# EAGLE design schematic_rev_1 (EAGLE 7.0.0)
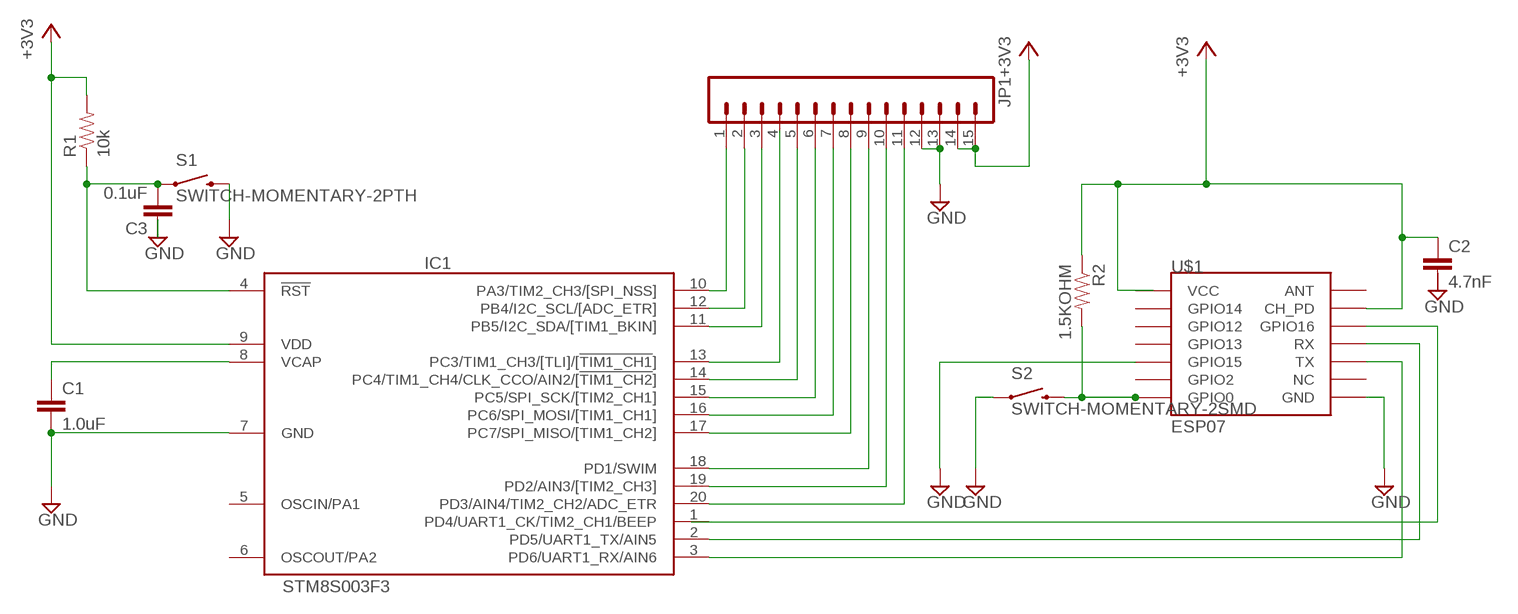
[diagram p0: schematic, sheet 1]

## Parts
C1  1.0uF  1.0UF-16V-10%(0402)  [0402-CAP]
C2  4.7nF  4.7NF-50V-10%(0603)  [0603-CAP]
C3  0.1uF  0.1UF-16V(+-10%)(0402)  [0402-CAP]
IC1  STM8S003F3  [TSSOP20]
JP1  M15  [1X15]
R1  10k  10KOHM-1/4W-1%(PTH)HORIZ  [AXIAL-0.3]
R2  1.5KOHM  1.5KOHM-1/10W-1%(0603)  [0603]
S1  SWITCH-MOMENTARY-2PTH  [TACTILE-PTH]
S2  SWITCH-MOMENTARY-2SMD  [TACTILE-SWITCH-SMD]
U$1  ESP07  [ESP07]

## Nets
+3V3: C2.1 IC1.9(VDD) JP1.14 JP1.15 R1.P$2 R2.1 U$1.CH_PD
GND: C1.2 C3.1 IC1.7(GND) JP1.12 JP1.13 S1.3 S2.1 U$1.GND U$1.GPIO15
N$3: C1.1 IC1.8(VCAP)
N$4: U$1.GPIO16
N$5: IC1.2(PD5/UART1_TX/AIN5) U$1.RX
N$6: IC1.10(PA3/TIM2_CH3/[SPI_NSS]) JP1.1
N$7: IC1.3(PD6/UART1_RX/AIN6) U$1.TX
N$8: IC1.12(PB4/I2C_SCL/[ADC_ETR]) JP1.2
N$9: IC1.11(PB5/I2C_SDA/[TIM1_BKIN]) JP1.3
N$10: IC1.13(PC3/TIM1_CH3/[TLI]/[!TIM1_CH1!]) JP1.4
N$11: IC1.14(PC4/TIM1_CH4/CLK_CCO/AIN2/[!TIM1_CH2!]) JP1.5
N$12: IC1.15(PC5/SPI_SCK/[TIM2_CH1]) JP1.6
N$13: IC1.16(PC6/SPI_MOSI/[TIM1_CH1]) JP1.7
N$14: IC1.17(PC7/SPI_MISO/[TIM1_CH2]) JP1.8
N$15: IC1.18(PD1/SWIM) JP1.9
N$16: IC1.19(PD2/AIN3/[TIM2_CH3]) JP1.10
N$17: IC1.20(PD3/AIN4/TIM2_CH2/ADC_ETR) JP1.11
N$18: C3.2 IC1.4(!RST) R1.P$1 S1.1
N$19: R2.2 S2.3 U$1.GPIO0
Unconnected: C2.2 IC1.1(PD4/UART1_CK/TIM2_CH1/BEEP) IC1.5(OSCIN/PA1) IC1.6(OSCOUT/PA2) U$1.ANT U$1.GPIO2 U$1.GPIO12 U$1.GPIO13 U$1.GPIO14 U$1.NC U$1.VCC

## Library data of the parts
C1 = SparkFun-Capacitors:1.0UF-16V-10%(0402); PROD_ID: CAP-12417
C2 = SparkFun-Capacitors:4.7NF-50V-10%(0603): CAP-11378; PROD_ID: CAP-11378
C3 = SparkFun-Capacitors:0.1UF-16V(+-10%)(0402); PROD_ID: CAP-12416
IC1 = stm8:STM8S003: Value line, 16 MHz STM8S 8-bit MCU, 8 Kbytes Flash, 128 bytes data EEPROM, 10-bit ADC, 3 timers, UART, SPI, I2C
JP1 = SparkFun-Connectors:M15: Header 15 Standard 15-pin 0.1" header. Use with straight break away headers (SKU : PRT-00116), right angle break away headers (PRT-00553), swiss pins (PRT-00743), machine pins (PRT-00117), and female headers (PRT-00115).
R1 = SparkFun-Resistors:10KOHM-1/4W-1%(PTH): RES-12183; PROD_ID: RES-12183
R2 = SparkFun-Resistors:1.5KOHM-1/10W-1%(0603): RES-08306; PROD_ID: RES-08306
S1 = SparkFun-Electromechanical:SWITCH-MOMENTARY-2: Various NO switches- pushbuttons, reed, etc; PROD_ID: SWCH-08441
S2 = SparkFun-Electromechanical:SWITCH-MOMENTARY-2: Various NO switches- pushbuttons, reed, etc; PROD_ID: SWCH-08247
U$1 = esp8266modules:ESP07: ESP8266 Wifi module 07 & 08

## Board
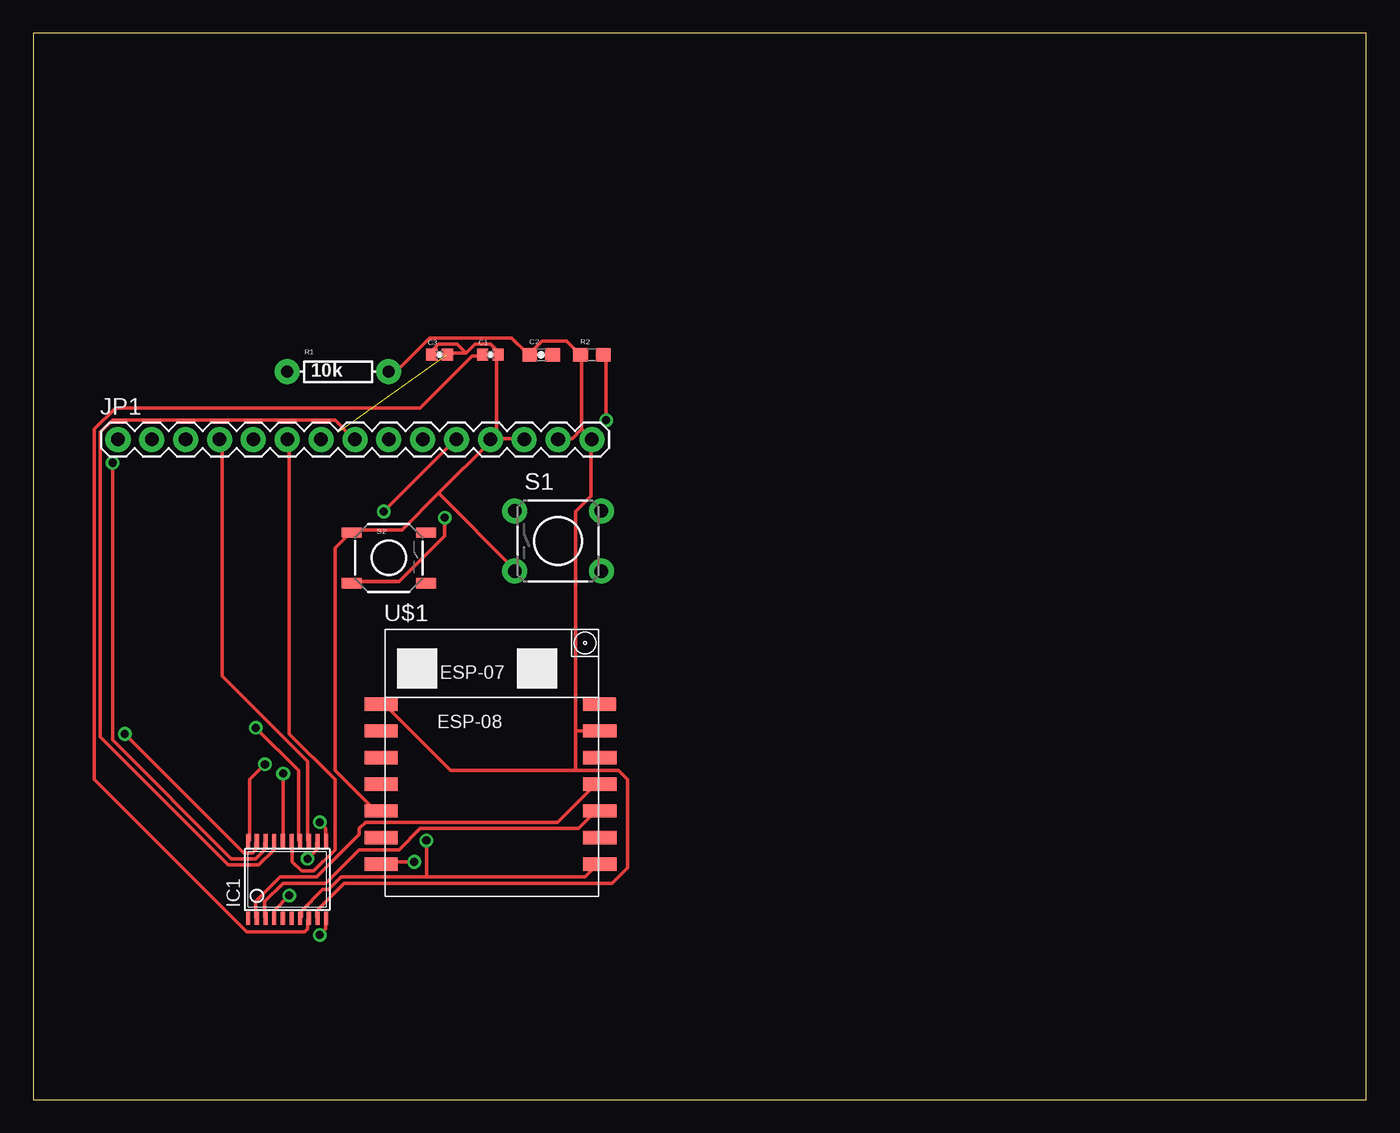
[diagram p1: board, top side]
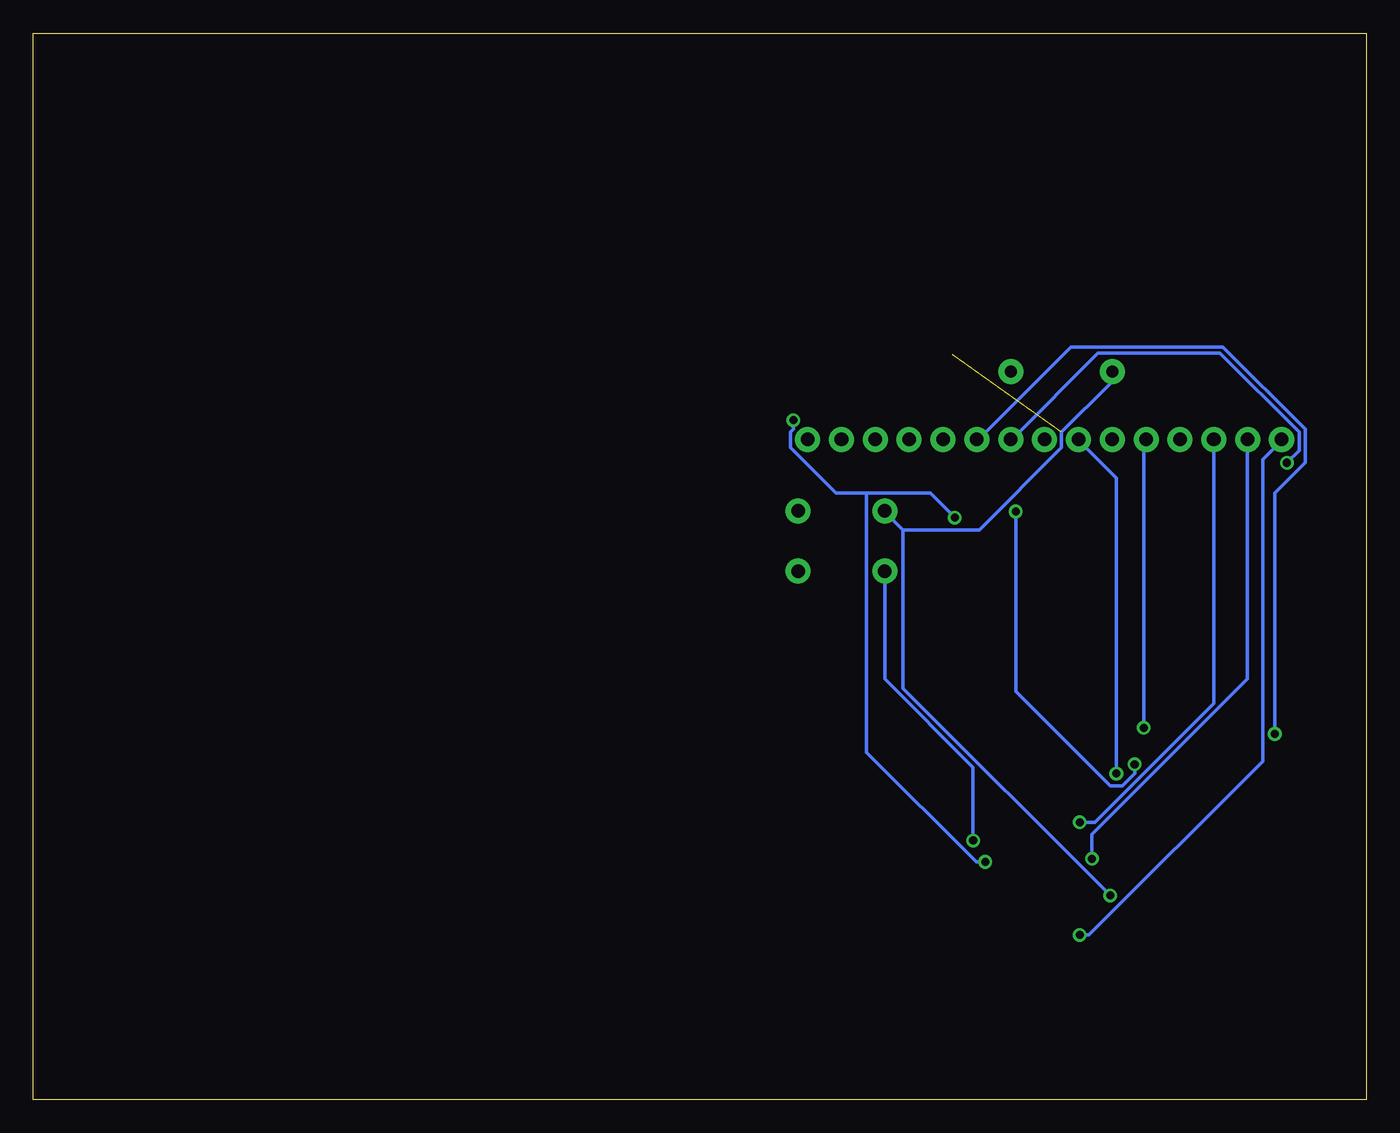
[diagram p2: board, bottom side, seen from below]

Size 100 x 80 mm. Coordinates in mm from the lower left corner, seen from the top.
Outline: 0,0 100,0 100,80 0,80 0,0
Copper layers (1*16): Top 0.035mm / dielectric 1.5mm / Bottom 0.035mm
Design rules "default": minimum track width 10mil, minimum drill 24mil, track to track 8mil, track to pad 8mil, pad to pad 8mil, via to via 8mil, smd to smd 8mil, copper to edge 40mil, drill to drill 8mil, minimum pad ring 10mil, minimum via ring 8mil, stop-mask expansion 4mil, vias tented up to drill 0mil, thermal gap 10mil

### Footprints (pad centres in the part's own frame; a part is rotated, then mirrored left to right if it is on the bottom)
0402-CAP = smd 0.85 x 0.9: 1 -0.58,0; 2 0.58,0
0603-CAP = smd 1.1 x 1: 1 -0.85,0; 2 0.85,0
TSSOP20 = smd 0.305 x 0.991: 1 -2.925,-2.918; 2 -2.275,-2.918; 3 -1.625,-2.918; 4 -0.975,-2.918; 5 -0.325,-2.918; 6 0.325,-2.918; 7 0.975,-2.918; 8 1.625,-2.918; 9 2.275,-2.918; 10 2.925,-2.918; 11 2.925,2.918; 12 2.275,2.918; 13 1.625,2.918; 14 0.975,2.918; 15 0.325,2.918; 16 -0.325,2.918; 17 -0.975,2.918; 18 -1.625,2.918; 19 -2.275,2.918; 20 -2.925,2.918
1X15 = drill 1.016 pad 1.88: 1 0,0; 2 2.54,0; 3 5.08,0; 4 7.62,0; 5 10.16,0; 6 12.7,0; 7 15.24,0; 8 17.78,0; 9 20.32,0; 10 22.86,0; 11 25.4,0; 12 27.94,0; 13 30.48,0; 14 33.02,0; 15 35.56,0
AXIAL-0.3 = drill 0.9 pad 1.88: P$1 -3.81,0; P$2 3.81,0
0603 = smd 1.1 x 1: 1 -0.85,0; 2 0.85,0
TACTILE-PTH = drill 1.016 pad 1.88: 1 -3.251,2.261; 2 3.251,2.261; 3 -3.251,-2.261; 4 3.251,-2.261
TACTILE-SWITCH-SMD = smd 1.524 x 0.762: 1 -2.794,1.905; 2 2.794,1.905; 3 -2.794,-1.905; 4 2.794,-1.905
ESP07 = smd 2.5 x 1: ANT 8.2,6.8; CH_PD 8.2,4.8; GND 8.2,-5.2; GPIO0 -8.2,-5.2; GPIO2 -8.2,-3.2; GPIO12 -8.2,2.8; GPIO13 -8.2,0.8; GPIO14 -8.2,4.8; GPIO15 -8.2,-1.2; GPIO16 8.2,2.8; NC 8.2,-3.2; RX 8.2,0.8; TX 8.2,-1.2; VCC -8.2,6.8

### Placement (x,y rotation side)
C1  34.29,55.88 0 top
C2  38.1,55.88 0 top
C3  30.48,55.88 0 top
IC1  19.05,16.51 0 top
JP1  6.35,49.53 0 top
R1  22.86,54.61 0 top
R2  41.91,55.88 0 top
S1  39.37,41.91 0 top
S2  26.67,40.64 0 top
U$1  34.29,22.86 0 top

### Tracks (layer width: path | path; a pad name or v marks a point on that pad's centre or on a via)
+3V3
  Top 0.254: 40.69,24.69 31.32,24.69 26.29,29.72 | 40.69,24.69 43.89,24.69 44.58,24 44.58,17.37 43.43,16.23 23.32,16.23 21.26,14.17 21.26,13.72 IC1.9 | 40.69,24.69 40.69,27.66 | 40.69,27.66 40.69,44.12 41.83,45.26 41.83,49.38 JP1.15 41.15,50.29 | 40.69,27.66 42.29,27.66 U$1.CH_PD | 41.15,50.29 41.15,55.78 R2.1 40.92,56.01 40.01,56.92 38.18,56.92 37.26,56.01 C2.1 37.03,56.01 35.89,57.15 29.72,57.15 27.2,54.63 26.75,54.63 R1.P$2 | 41.15,50.29 40.46,49.61 39.55,49.61 JP1.14
GND  (via drill 0.61)
  Top 0.254: 32.46,56.01 31.09,56.01 | 32.46,56.01 33.15,56.69 34.29,56.69 34.98,56.01 C1.2 34.75,55.78 34.75,50.06 | 34.75,50.06 34.29,49.61 JP1.12 34.29,49.38 30.4,45.49 | 34.75,50.06 35.2,49.61 36.8,49.61 JP1.13 | 29.49,16.69 41.38,16.69 42.29,17.6 U$1.GND | 29.49,16.69 23.09,16.69 22.17,15.77 21.72,15.77 20.12,14.17 20.12,13.72 IC1.7 | 32.46,56.01 31.77,56.69 30.4,56.69 29.95,56.24 29.95,56.01 C3.1 | 30.4,45.49 27.66,42.75 24,42.75 S2.1 23.77,42.52 22.63,41.38 22.63,24.69 25.6,21.72 26.06,21.72 U$1.GPIO15 | 30.4,45.49 36.12,39.78 S1.3 | v29.49,19.43 29.49,16.69
  Bottom 0.254: v29.49,19.43 29.49,24.92 36.12,31.55 S1.3
N$3
  Top 0.254: C1.1 33.6,55.78 32.92,55.78 29.03,51.89 6.17,51.89 4.57,50.29 4.57,24 16,12.57 20.34,12.57 20.57,12.8 20.57,13.49 IC1.8
N$5
  Top 0.254: IC1.2 16.69,13.72 16.69,14.86 18.52,16.69 21.26,16.69 24.46,19.89 24.46,20.34 24.92,20.8 39.32,20.8 42.29,23.77 U$1.RX
N$6  (via drill 0.61)
  Top 0.254: v21.49,12.34 21.95,12.8 21.95,13.49 IC1.10
  Bottom 0.254: v21.49,12.34 20.8,12.34 7.77,25.38 7.77,48.01 6.4,49.38 JP1.1
N$7
  Top 0.254: IC1.3 17.37,13.72 17.37,14.86 18.75,16.23 21.95,16.23 24.46,18.75 27.43,18.75 29.03,20.34 40.92,20.34 42.29,21.72 U$1.TX
N$8  (via drill 0.61)
  Top 0.254: v20.57,18.06 21.26,18.75 21.26,19.2 IC1.12
  Bottom 0.254: v20.57,18.06 20.57,19.89 8.91,31.55 8.91,49.38 JP1.2
N$9  (via drill 0.61)
  Top 0.254: v21.49,20.8 21.95,20.34 21.95,19.43 IC1.11
  Bottom 0.254: v21.49,20.8 20.34,20.8 11.43,29.72 JP1.3
N$10
  Top 0.254: IC1.13 20.57,19.43 20.57,25.38 14.17,31.77 14.17,49.38 JP1.4
N$11  (via drill 0.61)
  Top 0.254: v16.69,27.89 19.89,24.69 19.89,19.43 IC1.14
  Bottom 0.254: v16.69,27.89 16.69,49.38 JP1.5
N$12
  Top 0.254: IC1.15 19.43,19.2 19.43,17.83 20.12,17.14 21.03,17.14 22.63,18.75 22.63,24 19.2,27.43 19.2,49.38 JP1.6
N$13  (via drill 0.61)
  Top 0.254: v18.75,24.46 18.75,19.43 IC1.16
  Bottom 0.254: v18.75,24.46 18.75,46.63 21.49,49.38 JP1.7
N$14
  Top 0.254: IC1.17 18.06,19.2 18.06,18.75 16.92,17.6 14.63,17.6 5.03,27.2 5.03,50.06 5.94,50.98 22.63,50.98 24,49.61 JP1.8
N$15  (via drill 0.61)
  Top 0.254: v5.94,47.78 5.94,26.98 14.86,18.06 16.69,18.06 17.37,18.75 17.37,19.2 IC1.18
  Bottom 0.254: v5.94,47.78 5.03,48.69 5.03,50.06 10.97,56.01 20.12,56.01 26.52,49.61 JP1.9
N$16  (via drill 0.61)
  Top 0.254: v6.86,27.43 15.77,18.52 16.46,18.52 16.69,18.75 16.69,19.2 IC1.19
  Bottom 0.254: v6.86,27.43 6.86,45.49 4.57,47.78 4.57,50.29 10.74,56.46 22.17,56.46 29.03,49.61 JP1.10
N$17  (via drill 0.61)
  Top 0.254: v17.37,25.15 16.23,24 16.23,19.43 IC1.20 | v26.29,44.12 31.55,49.38 JP1.11
  Bottom 0.254: v17.37,25.15 17.37,24.46 18.29,23.55 19.2,23.55 26.29,30.63 v26.29,44.12
N$18  (via drill 0.61)  (1 unrouted)
  Top 0.254: v19.2,15.32 18.06,14.17 18.06,13.72 IC1.4
  Bottom 0.254: v19.2,15.32 34.75,30.86 34.75,42.75 | 34.75,42.75 36.12,44.12 S1.1 | 34.75,42.75 29.03,42.75 22.86,48.92 22.86,50.06 19.2,53.72 19.2,54.41 R1.P$1
N$19  (via drill 0.61)
  Top 0.254: v42.98,50.98 42.98,55.78 R2.2 | v30.86,43.66 30.86,42.29 27.43,38.86 24,38.86 S2.3 | v28.57,17.83 26.29,17.83 U$1.GPIO0
  Bottom 0.254: v42.98,50.98 42.98,50.29 43.2,50.06 43.2,48.92 39.78,45.49 37.49,45.49 | 37.49,45.49 32.69,45.49 v30.86,43.66 | v28.57,17.83 29.26,17.83 37.49,26.06 37.49,45.49